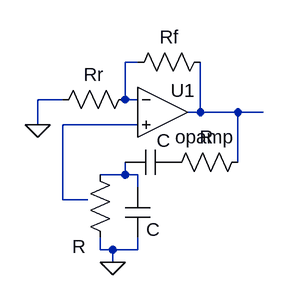
[diagram p0: schematic Oscillator.asc]
Oscillator.asc, the LTspice schematic file:
Version 4
SHEET 1 964 680
WIRE 800 -240 784 -240
WIRE 704 -192 672 -192
WIRE 784 -192 784 -240
WIRE 800 -192 784 -192
WIRE 880 -176 880 -240
WIRE 880 -176 864 -176
WIRE 928 -176 880 -176
WIRE 960 -176 928 -176
WIRE 672 -160 672 -192
WIRE 800 -160 704 -160
WIRE 928 -112 928 -176
WIRE 784 -96 784 -112
WIRE 784 -96 752 -96
WIRE 800 -96 784 -96
WIRE 800 -80 800 -96
WIRE 704 -64 704 -160
WIRE 736 -64 704 -64
WIRE 752 0 752 -16
WIRE 768 0 752 0
WIRE 800 0 800 -16
WIRE 800 0 768 0
WIRE 768 16 768 0
FLAG 672 -160 0
FLAG 768 16 0
SYMBOL Opamps\\opamp 832 -240 R0
WINDOW 0 10 37 Left 2
SYMATTR InstName U1
SYMBOL res 800 -208 R90
WINDOW 0 0 56 VBottom 2
WINDOW 3 -52 239 VTop 2
SYMATTR InstName Rr
SYMATTR Value ""
SYMBOL res 896 -256 R90
WINDOW 0 0 56 VBottom 2
WINDOW 3 -26 21 VTop 2
SYMATTR InstName Rf
SYMATTR Value ""
SYMBOL res 944 -128 R90
WINDOW 0 0 56 VBottom 2
WINDOW 3 32 56 VTop 2
SYMATTR InstName R
SYMATTR Value ""
SYMBOL cap 848 -128 R90
WINDOW 0 4 15 VBottom 2
WINDOW 3 33 30 VTop 2
SYMATTR InstName C
SYMATTR Value ""
SYMBOL cap 784 -80 R0
WINDOW 0 27 54 Left 2
SYMATTR InstName C
SYMATTR Value ""
SYMBOL res 736 -112 R0
WINDOW 0 -20 108 Left 2
WINDOW 3 -15 106 Left 2
SYMATTR InstName R
SYMATTR Value ""

The netlist it stands for:
* Oscillator.asc
XU1 N001 N003 N002 opamp Aol=100K GBW=10Meg  ; pins invin noninvin out
Rr N001 0
Rf N002 N001
R N002 P001
C P001 N004
C N004 0
R N004 0
.backanno
.end